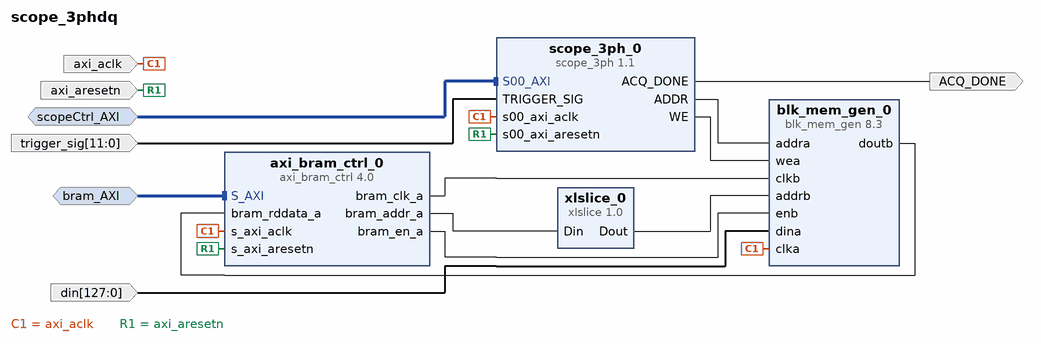
[diagram p0: block diagram of the top level]
# Vivado block design scope_3phdq, xc7z010clg400-1, Vivado 2017.2
create_bd_design scope_3phdq

create_bd_intf_port -mode Slave -vlnv xilinx.com:interface:aximm_rtl:1.0 bram_AXI
set_property -dict [list \
  CONFIG.DATA_WIDTH 32 \
  CONFIG.PROTOCOL AXI4LITE \
  CONFIG.ID_WIDTH 0 \
  CONFIG.ADDR_WIDTH 14 \
  CONFIG.AWUSER_WIDTH 0 \
  CONFIG.ARUSER_WIDTH 0 \
  CONFIG.WUSER_WIDTH 0 \
  CONFIG.RUSER_WIDTH 0 \
  CONFIG.BUSER_WIDTH 0 \
  CONFIG.READ_WRITE_MODE READ_WRITE \
  CONFIG.HAS_BURST 0 \
  CONFIG.HAS_LOCK 0 \
  CONFIG.HAS_PROT 1 \
  CONFIG.HAS_CACHE 0 \
  CONFIG.HAS_QOS 0 \
  CONFIG.HAS_REGION 0 \
  CONFIG.HAS_WSTRB 1 \
  CONFIG.HAS_BRESP 1 \
  CONFIG.HAS_RRESP 1 \
  CONFIG.SUPPORTS_NARROW_BURST 0 \
  CONFIG.NUM_READ_OUTSTANDING 2 \
  CONFIG.NUM_WRITE_OUTSTANDING 2 \
  CONFIG.MAX_BURST_LENGTH 1 \
  CONFIG.NUM_READ_THREADS 1 \
  CONFIG.NUM_WRITE_THREADS 1 \
  CONFIG.RUSER_BITS_PER_BYTE 0 \
  CONFIG.WUSER_BITS_PER_BYTE 0 \
] [get_bd_intf_ports bram_AXI]
create_bd_intf_port -mode Slave -vlnv xilinx.com:interface:aximm_rtl:1.0 scopeCtrl_AXI
set_property -dict [list \
  CONFIG.DATA_WIDTH 32 \
  CONFIG.PROTOCOL AXI4LITE \
  CONFIG.ID_WIDTH 0 \
  CONFIG.ADDR_WIDTH 16 \
  CONFIG.AWUSER_WIDTH 0 \
  CONFIG.ARUSER_WIDTH 0 \
  CONFIG.WUSER_WIDTH 0 \
  CONFIG.RUSER_WIDTH 0 \
  CONFIG.BUSER_WIDTH 0 \
  CONFIG.READ_WRITE_MODE READ_WRITE \
  CONFIG.HAS_BURST 0 \
  CONFIG.HAS_LOCK 0 \
  CONFIG.HAS_PROT 1 \
  CONFIG.HAS_CACHE 0 \
  CONFIG.HAS_QOS 0 \
  CONFIG.HAS_REGION 0 \
  CONFIG.HAS_WSTRB 1 \
  CONFIG.HAS_BRESP 1 \
  CONFIG.HAS_RRESP 1 \
  CONFIG.SUPPORTS_NARROW_BURST 0 \
  CONFIG.NUM_READ_OUTSTANDING 1 \
  CONFIG.NUM_WRITE_OUTSTANDING 1 \
  CONFIG.MAX_BURST_LENGTH 1 \
  CONFIG.NUM_READ_THREADS 1 \
  CONFIG.NUM_WRITE_THREADS 1 \
  CONFIG.RUSER_BITS_PER_BYTE 0 \
  CONFIG.WUSER_BITS_PER_BYTE 0 \
] [get_bd_intf_ports scopeCtrl_AXI]
create_bd_port -dir I -from 11 -to 0 trigger_sig
create_bd_port -dir I -from 127 -to 0 din
create_bd_port -dir I -type clk axi_aclk
create_bd_port -dir I -type rst axi_aresetn
create_bd_port -dir O -type intr ACQ_DONE

create_bd_cell -type ip -vlnv xilinx.com:ip:axi_bram_ctrl:4.0 axi_bram_ctrl_0
set_property -dict {CONFIG.PROTOCOL AXI4LITE CONFIG.SINGLE_PORT_BRAM 1} [get_bd_cells axi_bram_ctrl_0]
create_bd_cell -type ip -vlnv xilinx.com:ip:blk_mem_gen:8.3 blk_mem_gen_0
set_property -dict [list \
  CONFIG.Memory_Type Simple_Dual_Port_RAM \
  CONFIG.Enable_32bit_Address false \
  CONFIG.Use_Byte_Write_Enable false \
  CONFIG.Write_Width_A 128 \
  CONFIG.Write_Depth_A 1024 \
  CONFIG.Operating_Mode_A NO_CHANGE \
  CONFIG.Enable_A Always_Enabled \
  CONFIG.Write_Width_B 32 \
  CONFIG.Read_Width_B 32 \
  CONFIG.Enable_B Use_ENB_Pin \
  CONFIG.Register_PortB_Output_of_Memory_Primitives true \
  CONFIG.Port_B_Clock 100 \
  CONFIG.Port_B_Enable_Rate 100 \
  CONFIG.use_bram_block Stand_Alone \
] [get_bd_cells blk_mem_gen_0]
create_bd_cell -type ip -vlnv xilinx.com:ip:xlslice:1.0 xlslice_0
set_property -dict {CONFIG.DIN_TO 0 CONFIG.DIN_FROM 11 CONFIG.DIN_WIDTH 14 CONFIG.DOUT_WIDTH 12} [get_bd_cells xlslice_0]
create_bd_cell -type ip -vlnv PSC:lib3ph:scope_3ph:1.1 scope_3ph_0

# ---- connections ----

connect_bd_intf_net [get_bd_intf_ports bram_AXI] [get_bd_intf_pins axi_bram_ctrl_0/S_AXI]
connect_bd_intf_net [get_bd_intf_ports scopeCtrl_AXI] [get_bd_intf_pins scope_3ph_0/S00_AXI]
connect_bd_net [get_bd_ports trigger_sig] [get_bd_pins scope_3ph_0/TRIGGER_SIG]
connect_bd_net [get_bd_pins axi_bram_ctrl_0/bram_addr_a] [get_bd_pins xlslice_0/Din]
connect_bd_net [get_bd_pins axi_bram_ctrl_0/bram_clk_a] [get_bd_pins blk_mem_gen_0/clkb]
connect_bd_net [get_bd_pins axi_bram_ctrl_0/bram_en_a] [get_bd_pins blk_mem_gen_0/enb]
connect_bd_net [get_bd_pins blk_mem_gen_0/doutb] [get_bd_pins axi_bram_ctrl_0/bram_rddata_a]
connect_bd_net -net dina_1 [get_bd_ports din] [get_bd_pins blk_mem_gen_0/dina]
connect_bd_net -net s00_axi_aclk_1 [get_bd_ports axi_aclk] \
  [get_bd_pins axi_bram_ctrl_0/s_axi_aclk] [get_bd_pins blk_mem_gen_0/clka] [get_bd_pins scope_3ph_0/s00_axi_aclk]
connect_bd_net -net s00_axi_aresetn_1 [get_bd_ports axi_aresetn] [get_bd_pins axi_bram_ctrl_0/s_axi_aresetn] [get_bd_pins scope_3ph_0/s00_axi_aresetn]
connect_bd_net [get_bd_pins scope_3ph_0/ACQ_DONE] [get_bd_ports ACQ_DONE]
connect_bd_net [get_bd_pins scope_3ph_0/ADDR] [get_bd_pins blk_mem_gen_0/addra]
connect_bd_net [get_bd_pins scope_3ph_0/WE] [get_bd_pins blk_mem_gen_0/wea]
connect_bd_net [get_bd_pins xlslice_0/Dout] [get_bd_pins blk_mem_gen_0/addrb]

validate_bd_design
save_bd_design
